# EAGLE schematic BreakoutBoard (EAGLE 6.1)
AUTHOR: Sandor Szilvasi; AUTHOREMAIL: sandor.szilvasi@vanderbilt.edu; COPYRIGHT: Copyright © 2011 Vanderbilt University, ISIS; PAGE1: Cover Page; PAGE2: General Breakout; PAGE3: Power Board Specific; REVIEWER: Benjamin Babjak; REVIEWEREMAIL: benjamin.babjak@vanderbilt.edu; REVISION: B; TITLE: Smoky

## Sheet 1 of 2
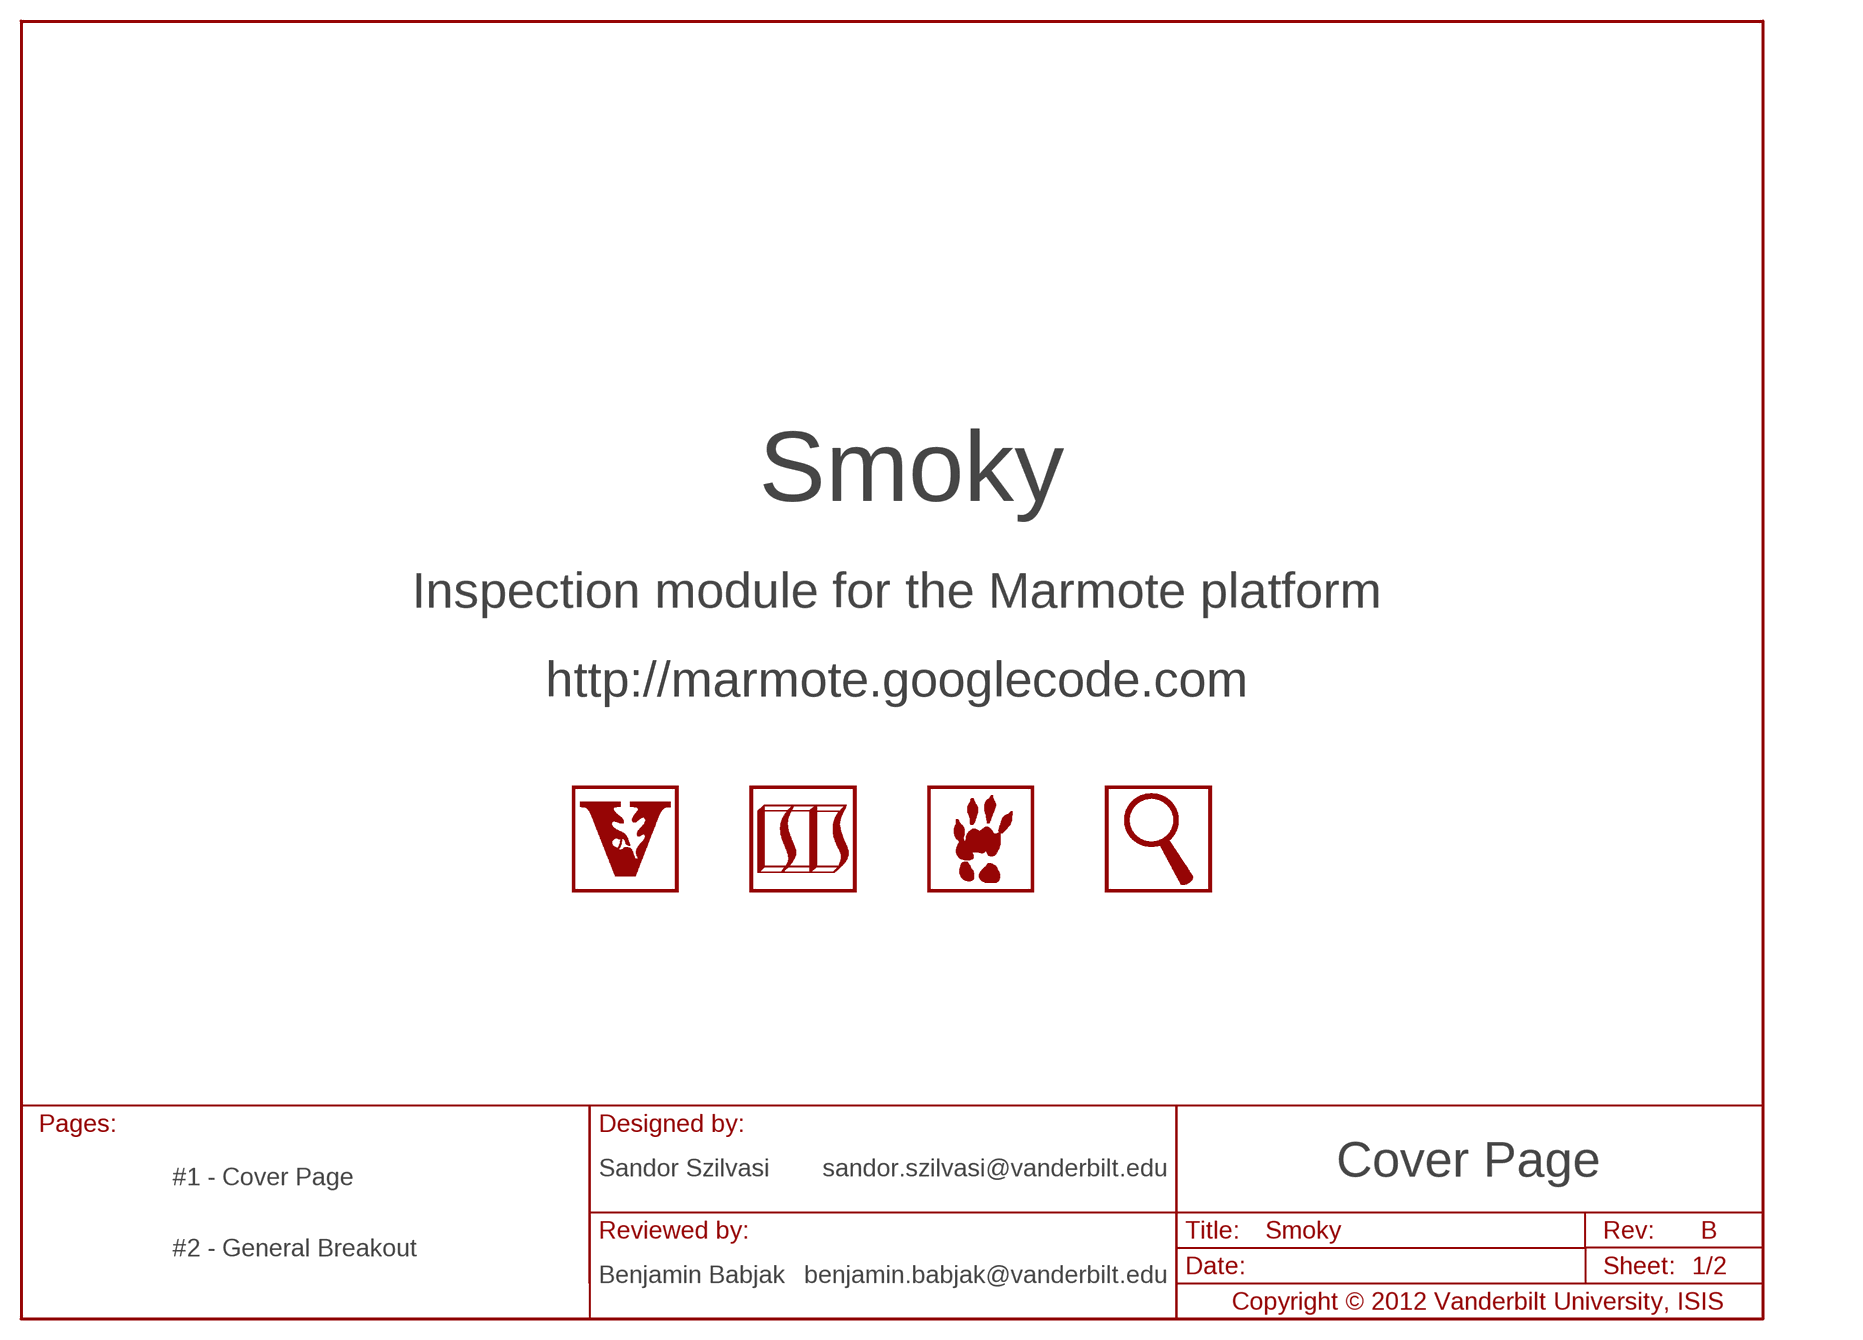
[diagram p0: schematic, sheet 1]

### Parts
LOGO1  LOGO-MAGNIFYING-GLASS-600MIL-10MM-SS  [LOGO-MAGNIFYING-GLASS-10MM-SILKSCREEN]
LOGO5  LOGO-VANDERBILT-600MIL-10MM-SS  [LOGO-VANDERBILT-10MM-SILKSCREEN]
LOGO6  LOGO-ISIS-600MIL-10MM-SS  [LOGO-ISIS-10MM-SILKSCREEN]
LOGO7  LOGO-MARMOTE-600MIL-10MM-SS  [LOGO-MARMOTE-10MM-SILKSCREEN]

### Notes on the sheet
- Inspection module for the Marmote platform
- http://marmote.googlecode.com

## Sheet 2 of 2
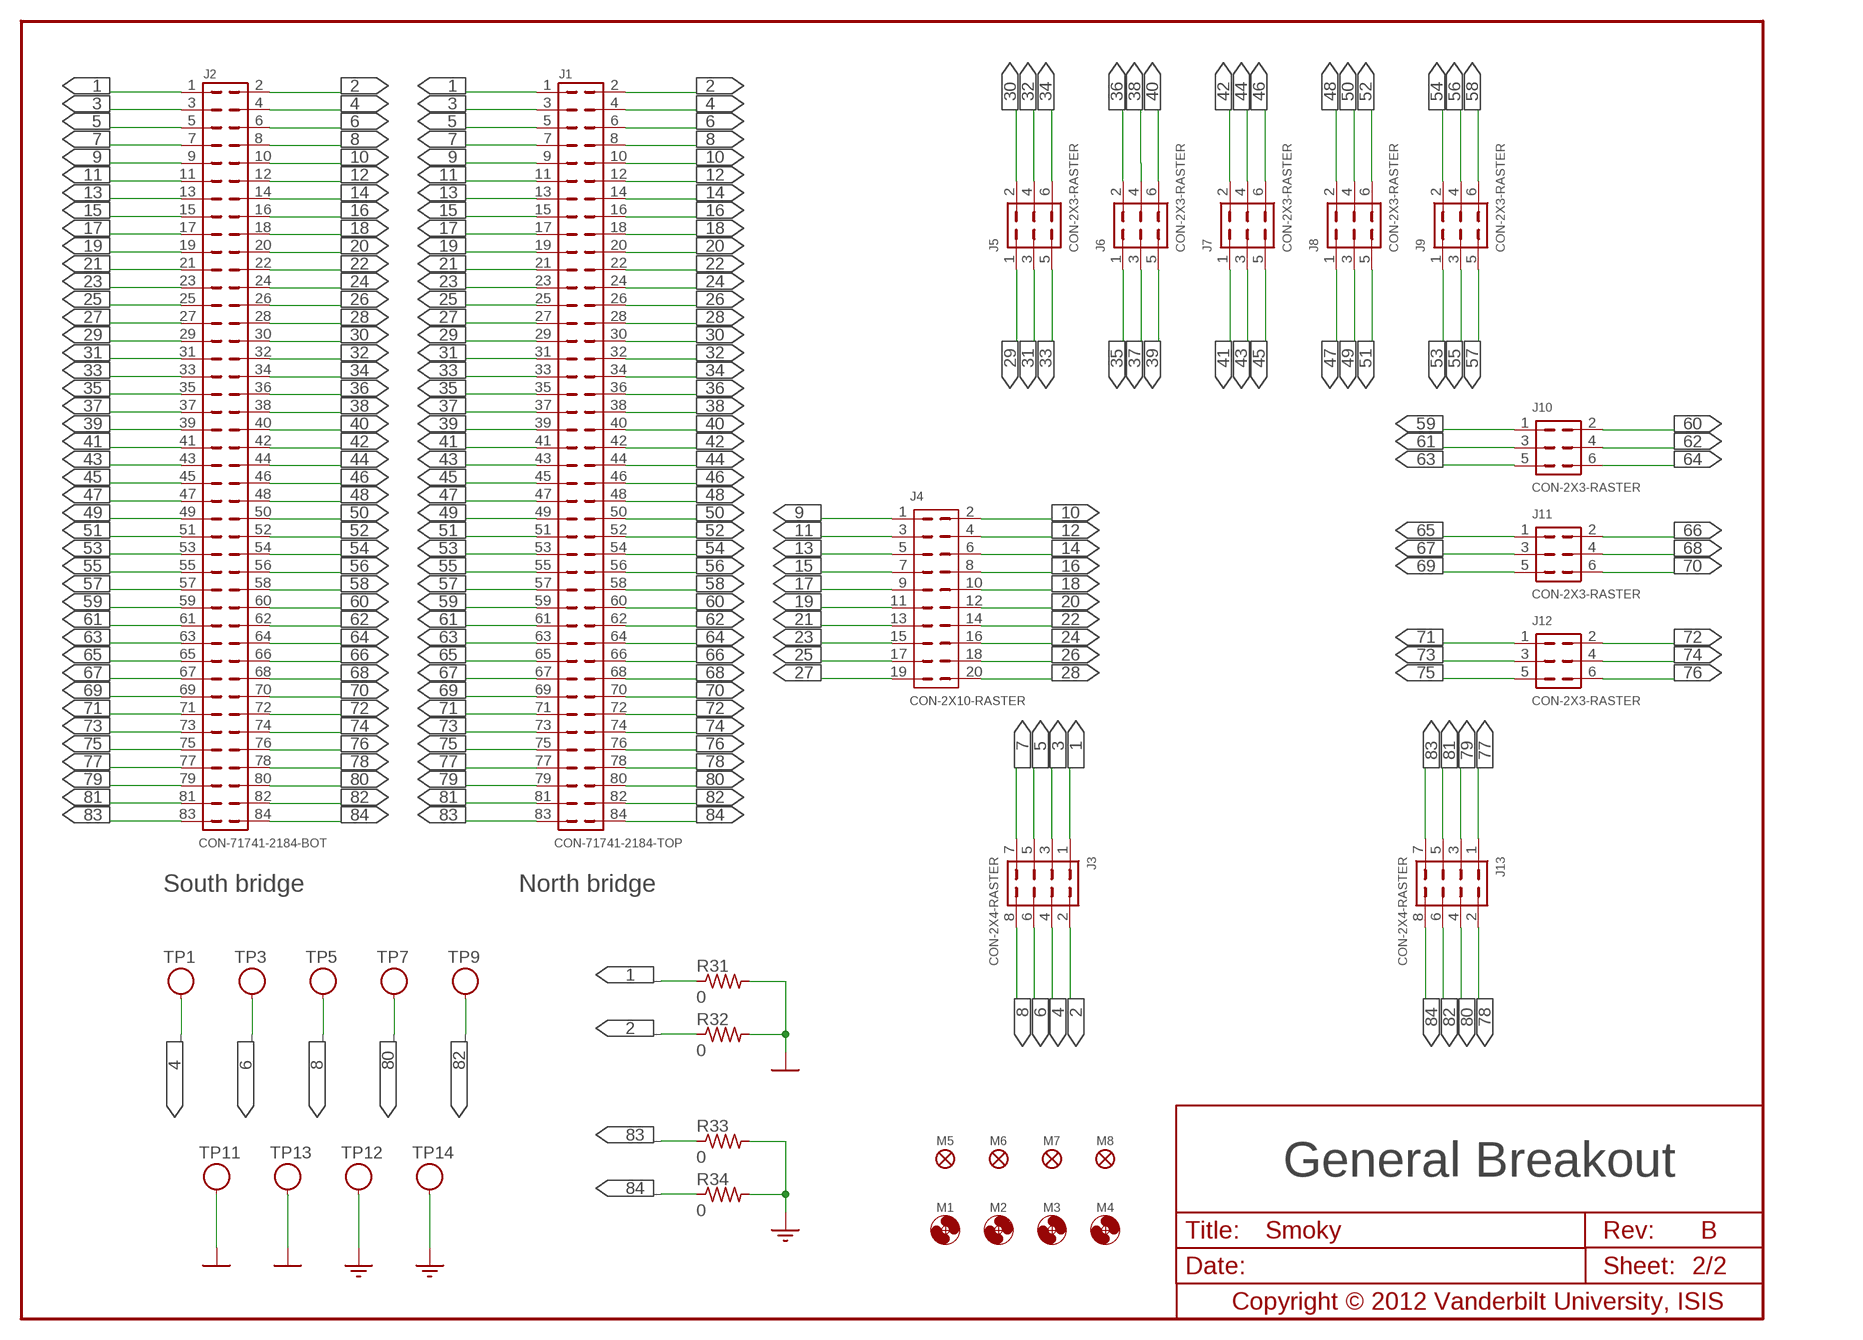
[diagram p1: schematic, sheet 2]

### Parts
J1  CON-71741-2184-TOP  [71741-0002]
J2  CON-71741-2184-BOT  [71742-3003-BOT]
J3  CON-2X4-RASTER  [2X8]
J4  CON-2X10-RASTER  [2X20]
J5  CON-2X3-RASTER  [2X6]
J6  CON-2X3-RASTER  [2X6]
J7  CON-2X3-RASTER  [2X6]
J8  CON-2X3-RASTER  [2X6]
J9  CON-2X3-RASTER  [2X6]
J10  CON-2X3-RASTER  [2X6]
J11  CON-2X3-RASTER  [2X6]
J12  CON-2X3-RASTER  [2X6]
J13  CON-2X4-RASTER  [2X8]
M1  MOUNT-HOLE3.3  [3,3]
M2  MOUNT-HOLE3.3  [3,3]
M3  MOUNT-HOLE3.3  [3,3]
M4  MOUNT-HOLE3.3  [3,3]
M5  FIDUCIAL1X2  [FIDUCIAL-1X2]
M6  FIDUCIAL1X2  [FIDUCIAL-1X2]
M7  FIDUCIAL1X2  [FIDUCIAL-1X2]
M8  FIDUCIAL1X2  [FIDUCIAL-1X2]
R31  0  R0805  [R0805]
R32  0  R0805  [R0805]
R33  0  R0805  [R0805]
R34  0  R0805  [R0805]
TP1  TESTPOINT-BLUE  [TESTPOINT]
TP3  TESTPOINT-BLUE  [TESTPOINT]
TP5  TESTPOINT-BLUE  [TESTPOINT]
TP7  TESTPOINT-GREEN  [TESTPOINT]
TP9  TESTPOINT-GREEN  [TESTPOINT]
TP11  TESTPOINT-YELLOW  [TESTPOINT]
TP12  TESTPOINT-YELLOW  [TESTPOINT]
TP13  TESTPOINT-YELLOW  [TESTPOINT]
TP14  TESTPOINT-YELLOW  [TESTPOINT]

### Nets
1: J1.1 J2.1 J3.1 R31.1
2: J1.2 J2.2 J3.2 R32.1
3: J1.3 J2.3 J3.3
4: J1.4 J2.4 J3.4 TP1.1
5: J1.5 J2.5 J3.5
6: J1.6 J2.6 J3.6 TP3.1
7: J1.7 J2.7 J3.7
8: J1.8 J2.8 J3.8 TP5.1
9: J1.9 J2.9 J4.1
10: J1.10 J2.10 J4.2
11: J1.11 J2.11 J4.3
12: J1.12 J2.12 J4.4
13: J1.13 J2.13 J4.5
14: J1.14 J2.14 J4.6
15: J1.15 J2.15 J4.7
16: J1.16 J2.16 J4.8
17: J1.17 J2.17 J4.9
18: J1.18 J2.18 J4.10
19: J1.19 J2.19 J4.11
20: J1.20 J2.20 J4.12
21: J1.21 J2.21 J4.13
22: J1.22 J2.22 J4.14
23: J1.23 J2.23 J4.15
24: J1.24 J2.24 J4.16
25: J1.25 J2.25 J4.17
26: J1.26 J2.26 J4.18
27: J1.27 J2.27 J4.19
28: J1.28 J2.28 J4.20
29: J1.29 J2.29 J5.1
30: J1.30 J2.30 J5.2
31: J1.31 J2.31 J5.3
32: J1.32 J2.32 J5.4
33: J1.33 J2.33 J5.5
34: J1.34 J2.34 J5.6
35: J1.35 J2.35 J6.1
36: J1.36 J2.36 J6.2
37: J1.37 J2.37 J6.3
38: J1.38 J2.38 J6.4
39: J1.39 J2.39 J6.5
40: J1.40 J2.40 J6.6
41: J1.41 J2.41 J7.1
42: J1.42 J2.42 J7.2
43: J1.43 J2.43 J7.3
44: J1.44 J2.44 J7.4
45: J1.45 J2.45 J7.5
46: J1.46 J2.46 J7.6
47: J1.47 J2.47 J8.1
48: J1.48 J2.48 J8.2
49: J1.49 J2.49 J8.3
50: J1.50 J2.50 J8.4
51: J1.51 J2.51 J8.5
52: J1.52 J2.52 J8.6
53: J1.53 J2.53 J9.1
54: J1.54 J2.54 J9.2
55: J1.55 J2.55 J9.3
56: J1.56 J2.56 J9.4
57: J1.57 J2.57 J9.5
58: J1.58 J2.58 J9.6
59: J1.59 J2.59 J10.1
60: J1.60 J2.60 J10.2
61: J1.61 J2.61 J10.3
62: J1.62 J2.62 J10.4
63: J1.63 J2.63 J10.5
64: J1.64 J2.64 J10.6
65: J1.65 J2.65 J11.1
66: J1.66 J2.66 J11.2
67: J1.67 J2.67 J11.3
68: J1.68 J2.68 J11.4
69: J1.69 J2.69 J11.5
70: J1.70 J2.70 J11.6
71: J1.71 J2.71 J12.1
72: J1.72 J2.72 J12.2
73: J1.73 J2.73 J12.3
74: J1.74 J2.74 J12.4
75: J1.75 J2.75 J12.5
76: J1.76 J2.76 J12.6
77: J1.77 J2.77 J13.1
78: J1.78 J2.78 J13.2
79: J1.79 J2.79 J13.3
80: J1.80 J2.80 J13.4 TP7.1
81: J1.81 J2.81 J13.5
82: J1.82 J2.82 J13.6 TP9.1
83: J1.83 J2.83 J13.7 R33.1
84: J1.84 J2.84 J13.8 R34.1
AGND: R33.2 R34.2 TP12.1 TP14.1
DGND: R31.2 R32.2 TP11.1 TP13.1

### Notes on the sheet
- South bridge | North bridge

## Library data of the parts
J1 = BreakoutBoard:CON-71741: Board-to-Board Connector 1.00mm (.039") Pitch Mezzanine Plug, Surface Mount, Dual Row, Vertical Stacking, 84 Circuits, 8.35mm (.329") Unmated Height, with PCB Locator Pegs, with Robotic Placement Metal Cap, 0.25µm (10µ") Gold (Au) Selective Plating, Embossed Tape on R Source: http://www.molex.com/molex/products/datasheet.jsp?part=active/0717410002_PCB_HEADERS.xml; DIGI-KEY#: WM3498CT-ND; MF: Molex; MPN: 71741-0002
J2 = BreakoutBoard:CON-71741: Board-to-Board Connector 1.00mm (.039") Pitch Mezzanine Plug, Surface Mount, Dual Row, Vertical Stacking, 84 Circuits, 8.35mm (.329") Unmated Height, with PCB Locator Pegs, with Robotic Placement Metal Cap, 0.25µm (10µ") Gold (Au) Selective Plating, Embossed Tape on R Source: http://www.molex.com/molex/products/datasheet.jsp?part=active/0717410002_PCB_HEADERS.xml; DIGI-KEY#: WM3499CT-ND; MF: Molex; MPN: 71742-3003
J3 J13 = BreakoutBoard:CON-2X4-RASTER
J4 = BreakoutBoard:CON-2X10-RASTER
J5-J12 = BreakoutBoard:CON-2X3-RASTER
LOGO1 = Logo:LOGO-MAGNIFYING-GLASS-600MIL: Magnifying Glass Logo Logo for the breakout board of the Marmote platform. Generated from 360 x 360 px bitmap and scaled to 600 x 600 mil. v1.0 Initial design
LOGO5 = Logo:LOGO-VANDERBILT-600MIL: Vanderbilt Logo Official Framed Vanderbilt Logo Generated from 360 x 360 px bitmap and scaled to 600 x 600 mil v1.1 Source bitmap smoothened v1.0 Initial design
LOGO6 = Logo:LOGO-ISIS-600MIL: ISIS Logo Official logo of the Institute for Software Integrated Systems (ISIS), Vanderbilt as of 2011 Generated from 360 x 360 px bitmap and scaled to 600 x 600 mil v1.0 Initial design
LOGO7 = Logo:LOGO-MARMOTE-600MIL: Marmote Platform Logo Preliminary logo for the Marmote Platform (http://marmote.googlecode.com) Generated from 360 x 360 px bitmap and scaled to 600 x 600 mil v1.1 Source bitmap smoothened v1.0 Initial design
M1-M4 = powerboard:MOUNT-HOLE: MOUNTING HOLE with drill center marker
M5-M8 = powerboard:FIDUCIAL: Fiducial Alignment Points Various fiducial points for machine vision alignment.
R31-R34 = BreakoutBoard:R: RESISTOR
TP1 TP3 TP5 = BreakoutBoard:TESTPOINT: Test Point Keystone compact through hole mount test point for SUPPLY and GROUND signals Terminal: .015 (.38) × .032 (.81) thick Phosphor Bronze Wire, Silver Plate Base: Nylon 46, UL Rated 94V-0 Mtg. Hole: .063 (1.6) Diameter Source: http://www.keyelco.com/pdfs/M55p51.pdf; DIGI-KEY#: 5122K-ND; MF: Keystone; MPN: 5122
TP7 TP9 = BreakoutBoard:TESTPOINT: Test Point Keystone compact through hole mount test point for SUPPLY and GROUND signals Terminal: .015 (.38) × .032 (.81) thick Phosphor Bronze Wire, Silver Plate Base: Nylon 46, UL Rated 94V-0 Mtg. Hole: .063 (1.6) Diameter Source: http://www.keyelco.com/pdfs/M55p51.pdf; DIGI-KEY#: 5121K-ND; MF: Keystone; MPN: 5121
TP11-TP14 = BreakoutBoard:TESTPOINT: Test Point Keystone compact through hole mount test point for SUPPLY and GROUND signals Terminal: .015 (.38) × .032 (.81) thick Phosphor Bronze Wire, Silver Plate Base: Nylon 46, UL Rated 94V-0 Mtg. Hole: .063 (1.6) Diameter Source: http://www.keyelco.com/pdfs/M55p51.pdf; DIGI-KEY#: 5009K-ND; MF: Keystone; MPN: 5009